# Altium schematic sheet Beleuchtung.SchDoc: Beleuchtung
size A4; Date: 10.11.2025; Author: Alexander Schiechtl; Revision: v1.0; SheetNumber: 7; SheetTotal: 7; Project: 3D-Scanner
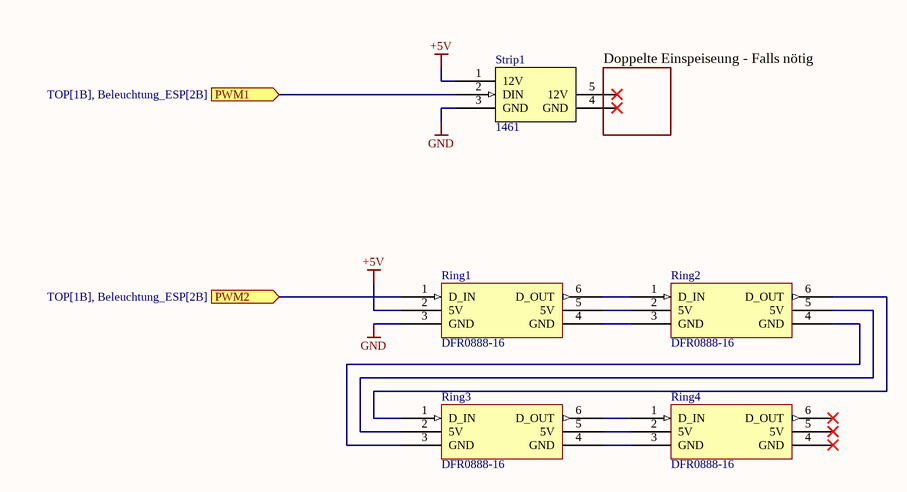
[diagram p0: Beleuchtung.SchDoc]

## Parts
Ring1  DFR0888-16
Ring2  DFR0888-16
Ring3  DFR0888-16
Ring4  DFR0888-16
Strip1  1461

## Ports
PWM1 (in, see TOP[1B], Beleuchtung_ESP[2B]), PWM2 (in, see TOP[1B], Beleuchtung_ESP[2B])

## Nets
+5V: Ring1.2(5V) Strip1.1(12V)
GND: Ring1.3(GND) Strip1.3(GND)
PWM1: Strip1.2(DIN) ; port PWM1
PWM2: Ring1.1(D_IN) ; port PWM2
NetRing1_4: Ring1.4(GND) Ring2.3(GND)
NetRing1_5: Ring1.5(5V) Ring2.2(5V)
NetRing1_6: Ring1.6(D_OUT) Ring2.1(D_IN)
NetRing2_4: Ring2.4(GND) Ring3.3(GND)
NetRing2_5: Ring2.5(5V) Ring3.2(5V)
NetRing2_6: Ring2.6(D_OUT) Ring3.1(D_IN)
NetRing3_4: Ring3.4(GND) Ring4.3(GND)
NetRing3_5: Ring3.5(5V) Ring4.2(5V)
NetRing3_6: Ring3.6(D_OUT) Ring4.1(D_IN)

Not connected (* = marked no-connect by the designer): Ring4 4(GND)* 5(5V)* 6(D_OUT)*; Strip1 4(GND)* 5(12V)*

## Notes on the sheet
- (near Strip1) Doppelte Einspeiseung - Falls nötig
- Project:
- Title:
- Leitner AG
- Zona Artigianale Est 7
- 39040 Racines BZ
- Italy
- Confidential
- Author:
- Document name:
- Date:
- Version:
- Size:
- A4

## Library data of the parts
Ring1-Ring4 = RGB Ring: DFRobot, DFR0888-16. / WS2812-16 RGB LED RING LAMP
Strip1 = RGB Strip: ADDRESS LED STRIP SERIAL RGB 4M, Adafruit, 1461